# Altium project NodeLORA.PrjPcb
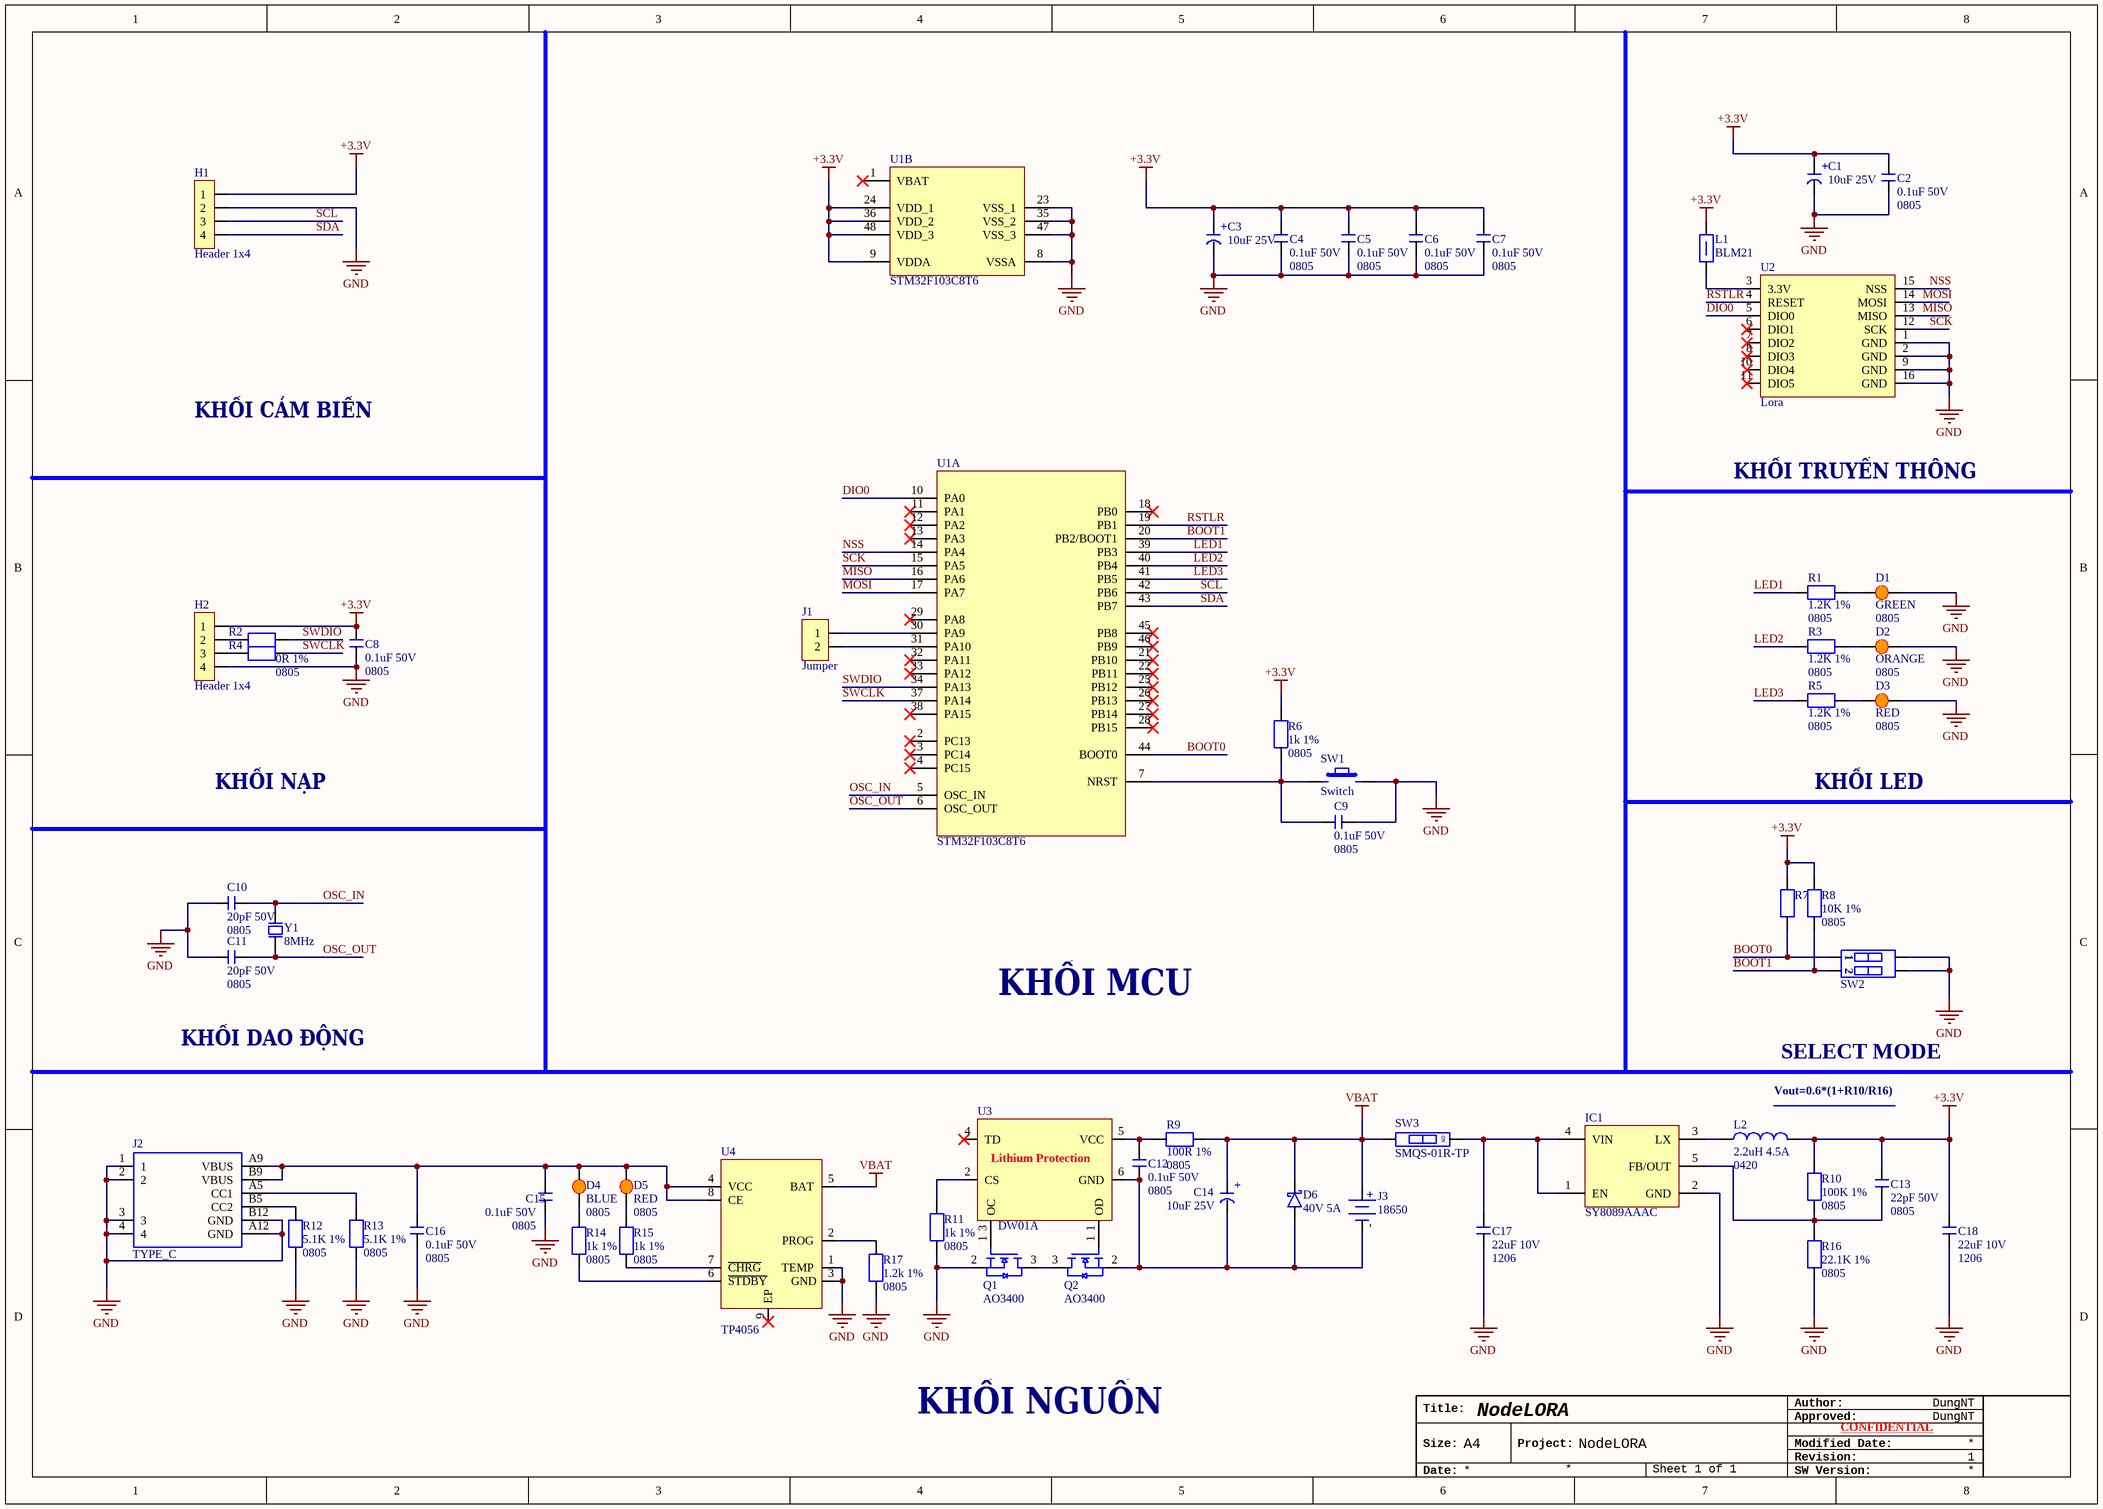
[diagram p0: NodeLORA.SchDoc]
1 sheet, 59 parts. Net scope: global (net labels, ports and power ports of the same name join across sheets).
Board file: NodeLORA.PcbDoc

## Sheet NodeLORA.SchDoc: NodeLORA
size A3; ApprovedBy: DungNT; Author: DungNT; Revision: 1; SheetNumber: 1; SheetTotal: 1; ProjectTitle: NodeLORA

### Parts
C1  10uF 25V  [CAP-ALU-B]
C2  0.1uF 50V  Package: 0805  [C0805]
C3  10uF 25V  [CAP-ALU-B]
C4  0.1uF 50V  Package: 0805  [C0805]
C5  0.1uF 50V  Package: 0805  [C0805]
C6  0.1uF 50V  Package: 0805  [C0805]
C7  0.1uF 50V  Package: 0805  [C0805]
C8  0.1uF 50V  Package: 0805  [C0805]
C9  0.1uF 50V  Package: 0805  [C0805]
C10  20pF 50V  Package: 0805  [C0805]
C11  20pF 50V  Package: 0805  [C0805]
C12  0.1uF 50V  Package: 0805  [C0805]
C13  22pF 50V  Package: 0805  [C0805]
C14  10uF 25V  [CAP-ALU-B]
C15  0.1uF 50V  Package: 0805  [C0805]
C16  0.1uF 50V  Package: 0805  [C0805]
C17  22uF 10V  Package: 1206  [C1206]
C18  22uF 10V  Package: 1206  [C1206]
D1  GREEN  Package: 0805  [L0805-GREEN]
D2  ORANGE  Package: 0805  [L0805-ORANGE]
D3  RED  Package: 0805  [L0805-RED]
D4  BLUE  Package: 0805  [L0805-BLUE]
D5  RED  Package: 0805  [L0805-RED]
D6  40V 5A  [SMA(DO-214AC)]
H1  Header 1x4  [H1x4M]
H2  Header 1x4  [H1x4M]
IC1  SY8089AAAC  [SOT-23-5]
J1  Jumper  [JUMPER2x]
J2  TYPE_C  [TYPE C 6P]
J3  18650  [18650-PLUGIN]
L1  BLM21  [L0805]
L2  2.2uH 4.5A  Package: 0420  [L0420]
Q1  AO3400  [SOT-23]
Q2  AO3400  [SOT-23]
R1  1.2K 1%  Package: 0805  [R0805]
R2  0R 1%  [R0805]  (value not drawn)
R3  1.2K 1%  Package: 0805  [R0805]
R4  0R 1%  Package: 0805  [R0805]
R5  1.2K 1%  Package: 0805  [R0805]
R6  1k 1%  Package: 0805  [R0805]
R7  10K 1%  [R0805]  (value not drawn)
R8  10K 1%  Package: 0805  [R0805]
R9  100R 1%  Package: 0805  [R0805]
R10  100K 1%  Package: 0805  [R0805]
R11  1k 1%  Package: 0805  [R0805]
R12  5.1K 1%  Package: 0805  [R0805]
R13  5.1K 1%  Package: 0805  [R0805]
R14  1k 1%  Package: 0805  [R0805]
R15  1k 1%  Package: 0805  [R0805]
R16  22.1K 1%  Package: 0805  [R0805]
R17  1.2k 1%  Package: 0805  [R0805]
SW1  Switch  [SW_6X3.5mm_2SMD]
SW2  VDG-02HG-R  [DIPSWITCHES_2P]  (value not drawn)
SW3  SMQS-01R-TP  [SMSWITCH_1P]
U1  STM32F103C8T6  [LQFP-48]  (parts A,B of 2)
U2  Lora  [RA-02-SX1278]
U3  DW01A  [SOT-23-6]
U4  TP4056  [ESOP-8]
Y1  8MHz  [5032-2]

### Nets
+3.3V: C1.1 C2.2 C3.1 C4.2 C5.2 C6.2 C7.2 C8.2 C13.2 C18.2 H1.1 H2.1 L1.2 L2.2 R6.1 R7.2 R8.2 R10.2 U1.9(VDDA) U1.24(VDD_1) U1.36(VDD_2) U1.48(VDD_3)
GND: C1.2 C2.1 C3.2 C4.1 C5.1 C6.1 C7.1 C8.1 C9.1 C10.1 C11.1 C15.1 C16.1 C17.1 C18.1 D1.2 D2.2 D3.2 H1.2 H2.4 IC1.2(GND) J2.1 J2.2 J2.3 J2.4 J2.A12(GND) J2.B12(GND) Q1.2(Source) R11.2 R12.1 R13.1 R16.1 R17.1 SW1.2 SW2.3 SW2.4 U1.8(VSSA) U1.23(VSS_1) U1.35(VSS_2) U1.47(VSS_3) U2.1(GND) U2.2(GND) U2.9(GND) U2.16(GND) U4.1(TEMP) U4.3(GND)
VBAT: C14.1 D6.2 J3.1 R9.2 SW3.1 U4.5(BAT)
BOOT0: R7.1 SW2.1 U1.44(BOOT0)
BOOT1: R8.1 SW2.2 U1.20(PB2/BOOT1)
DIO0: U1.10(PA0) U2.5(DIO0)
LED1: R1.1 U1.39(PB3)
LED2: R3.1 U1.40(PB4)
LED3: R5.1 U1.41(PB5)
MISO: U1.16(PA6) U2.13(MISO)
MOSI: U1.17(PA7) U2.14(MOSI)
NSS: U1.14(PA4) U2.15(NSS)
OSC_IN: C10.2 U1.5(OSC_IN) Y1.2
OSC_OUT: C11.2 U1.6(OSC_OUT) Y1.1
RSTLR: U1.19(PB1) U2.4(RESET)
SCK: U1.15(PA5) U2.12(SCK)
SCL: H1.3 U1.42(PB6)
SDA: H1.4 U1.43(PB7)
SWCLK: R4.2 U1.37(PA14)
SWDIO: R2.2 U1.34(PA13)
NetC9_2: C9.2 R6.2 SW1.1 U1.7(NRST)
NetC12_1: C12.1 C14.2 D6.1 J3.2 Q2.2(Source) U3.6(GND)
NetC12_2: C12.2 R9.1 U3.5(VCC)
NetC13_1: C13.1 IC1.5(FB/OUT) R10.1 R16.2
NetC15_2: C15.2 C16.2 D4.1 D5.1 J2.A9(VBUS) J2.B9(VBUS) U4.4(VCC) U4.8(CE)
NetC17_2: C17.2 IC1.1(EN) IC1.4(VIN) SW3.2
NetD1_1: D1.1 R1.2
NetD2_1: D2.1 R3.2
NetD3_1: D3.1 R5.2
NetD4_2: D4.2 R14.1
NetD5_2: D5.2 R15.1
NetH2_2: H2.2 R2.1
NetH2_3: H2.3 R4.1
NetIC1_3: IC1.3(LX) L2.1
NetJ1_1: J1.1 U1.30(PA9)
NetJ1_2: J1.2 U1.31(PA10)
NetJ2_A5: J2.A5(CC1) R13.2
NetJ2_B5: J2.B5(CC2) R12.2
NetL1_1: L1.1 U2.3(3.3V)
NetQ1_1: Q1.1(Gate) U3.3(OC)
NetQ1_3: Q1.3(Drain) Q2.3(Drain)
NetQ2_1: Q2.1(Gate) U3.1(OD)
NetR11_1: R11.1 U3.2(CS)
NetR14_2: R14.2 U4.6(~{STDBY})
NetR15_2: R15.2 U4.7(~{CHRG})
NetR17_2: R17.2 U4.2(PROG)

Not connected (* = marked no-connect by the designer): U1 1(VBAT)* 2(PC13)* 3(PC14)* 4(PC15)* 11(PA1)* 12(PA2)* 13(PA3)* 18(PB0)* 21(PB10)* 22(PB11)* 25(PB12)* 26(PB13)* 27(PB14)* 28(PB15)* 29(PA8)* 32(PA11)* 33(PA12)* 38(PA15)* 45(PB8)* 46(PB9)*; U2 6(DIO1)* 7(DIO2)* 8(DIO3)* 10(DIO4)* 11(DIO5)*; U3 4(TD)*; U4 9(EP)*

### Notes on the sheet
- KHỐI CẢM BIẾN
- KHỐI TRUYỀN THÔNG
- KHỐI NẠP
- KHỐI LED
- KHỐI DAO ĐỘNG
- KHỐI MCU
- (near L2) Vout=0.6*(1+R10/R16)
- SELECT MODE
- KHỐI NGUỒN
- Author:
- Title:
- Size:
- A4
- Project:
- Approved:
- Revision:
- Modified Date:
- CONFIDENTIAL
- Date:
- SW Version:
- (in symbol BitSwitch_1P) ON
- (in symbol CAP_ALU_B_10uF_25V) +
- (in symbol DW01A) Lithium Protection
- (in symbol Lithium 18650) +; -

### Library data of the parts
C1 C3 C14 = CAP_ALU_B_10uF_25V: 10uF 25V 15mA@120Hz ±20% SMD,D4xL5.4mm Aluminum Electrolytic Capacitors - SMD ROHS; Manufacturer: DMBJ; Manufacturer Product Number: RVT1E100M0405 10UF 25V; Link: https://www.lcsc.com/product-detail/Aluminum-Electrolytic-Capacitors-SMD_DMBJ-RVT1E100M0405-10UF-25V_C970655.html; Price: $ 0.0183; Size: B
C2 C4-C9 C12 C15 C16 = C0805_0.1uF_50V_10%: 0.1 µF ±10% 50V Ceramic Capacitor X7R 0805 (2012 Metric); Manufacturer: YAGEO; Manufacturer Product Number: CC0805KRX7R9BB104; VNprice: 180; Link: https://www.digikey.com/en/products/detail/yageo/CC0805KRX7R9BB104/302874; Price: 0.10; VNlink: https://linhkien.cxt.vn/1976-tu-104k-01uf-100nf-0805-50v-10-10c.html
C10 C11 = C0805_20pF_50V_10%: 20 pF ±10% 50V Ceramic Capacitor X7R 0805 (2012 Metric); Manufacturer: KEMET; Manufacturer Product Number: C0805C200K5RAC7800; VNprice: 180; Link: https://www.digikey.com/en/products/detail/kemet/C0805C200K5RAC7800/8572459; Price: 0.28; VNlink: https://linhkien.cxt.vn/2901-tu-20pf-0805-50v-10c.html
C13 = C0805_22pF_50V_10%: 22 pF ±10% 50V Ceramic Capacitor C0G, NP0 0805 (2012 Metric); Manufacturer: KEMET; Manufacturer Product Number: C0805C220K5GAC7800; VNprice: 180; Link: https://www.digikey.com/en/products/detail/kemet/C0805C220K5GAC7800/2212195; Price: 0.1; VNlink: https://linhkien.cxt.vn/1061-tu-khong-phan-cuc-0805.html
C17 C18 = C1206_22uF_10V_10%: 22 µF ±20% 10V Ceramic Capacitor X7R 1206 (3216 Metric); Manufacturer: Samsung Electro-Mechanics; Manufacturer Product Number: CL31B226MPHNNNE; VNprice: 400; Link: https://www.digikey.com/en/products/detail/samsung-electro-mechanics/CL31B226MPHNNNE/3888806; Price: 0.37; VNlink: https://linhkien.cxt.vn/4805-tu-khong-phan-cuc-1206.html
D1 = LED_0805_GREEN: Green 570nm LED Indication - Discrete 2.1V 0805 (2012 Metric); Manufacturer: Kingbright; Manufacturer Product Number: APHCM2012CGCK-F01; VNprice: 530; Link: https://www.digikey.com/en/products/detail/kingbright/APHCM2012CGCK-F01/1747492?s=N4IgTCBcDaIAQEEAKAJAwgWTABgIxjQHE0BpAMTxAF0BfIA; Price: 0.34; VNlink: https://linhkien.cxt.vn/10107-17-21ghc-yr1t13t-led-0805-sang-mau-xanh-luc-emerald-10c.html
D2 = LED_0805_ORANGE: Orange 601nm LED Indication - Discrete 2.1V 0805 (2012 Metric); Manufacturer: Kingbright; Manufacturer Product Number: APHCM2012SECKF01; VNprice: 230; Link: https://www.digikey.com/en/products/detail/kingbright/APHCM2012SECK-F01/1747494?s=N4IgTCBcDaIIIAUASBhAsmADARjAZQFEUBpAMRxAF0BfIA; Price: 0.32; VNlink: https://linhkien.cxt.vn/6701-led-0805-cac-mau.html
D3 D5 = LED_0805_RED: 20mA 350mcd Colorless transparent lens 625nm Red 120° 2.2V 0805 LED Indication - Discrete ROHS; Manufacturer: Kingbright; Manufacturer Product Number: APT2012SECK/J3-PRV; VNprice: 530; Link: https://www.lcsc.com/product-detail/span-style-background-color-ff0-LED-span-Indication-Discrete_Kingbright-APT2012SECK-J3-PRV_C5569452.html; Price: 0.2831; VNlink: https://linhkien.cxt.vn/10106-17-21surcs530-a3tr8-led-red-0805-624nm-10c.html
D4 = LED_0805_BLUE: Blue 470nm LED Indication - Discrete 3.3V 0805 (2012 Metric); Manufacturer: LiteOnInc; Manufacturer Product Number: LTSTC170TBKT; VNprice: 600; Link: https://www.digikey.com/en/products/detail/liteon/LTST-C170TBKT/388527?s=N4IgTCBcDaIAQBkAqBlJBhAjAdgAxICEBpJEAXQF8g; Price: 0.38; VNlink: https://linhkien.cxt.vn/6340-150080bs75000-led-sang-mau-xanh-duong-blue-clear-0805-smd.html
D6 = Diode_40V_5V_SMA: 40V Independent Type 550mV@5.0A 5A SMA(DO-214AC) Schottky Diodes ROHS; Manufacturer: hongjiacheng; Manufacturer Product Number: SS54; VNprice: 1600; Link: https://www.lcsc.com/product-detail/Schottky-Diodes_hongjiacheng-SS54_C7420369.html; Price: 0.0336; Package: SMA(DO-214AC); VNlink: https://linhkien.cxt.vn/8500-1n5824-ss54-sma-diode-schottky-5a-40v.html
H1 H2 = Header 1x4 2.54mm: Connector Header 4 position; Manufacturer: Adam Tech; Manufacturer Product Number: ADT-AMP1251104S2BS192A1; Link: https://www.digikey.com/en/products/detail/adam-tech/ADT-AMP1251104S2BS192A1/9832039; Price: 0.30000
IC1 = SY8089AAAC: Step-down type 2A 2.7V~5.5V SOT-23-5 DC-DC Converters ROHS; Manufacturer: MaxLinear, Inc.; Manufacturer Product Number: SPX3819M5-L-3-3/TR; VNprice: 3500; Current - Quiescent (Iq): 8 µA; Current - Supply (Max): 30 mA; Voltage - Input (Max): 16V; Link: https://www.lcsc.com/product-detail/DC-DC-Converters_Silergy-Corp-SY8089AAAC_C78988.html; Price: 0.1481; VNlink: https://linhkien.cxt.vn/5370-sy8089a1aac-conv-dc-dc-single-step-down-55v-sot-23.html; Package: SOT-23-5; Input Voltage: 2.7V~5.5V; Current - Output: 2A; Operating Temperature: -40℃~+85℃@(TA); Topology: Step-down
J1 = Jumper 2P: 40 Position Receptacle Connector 0.100" (2.54mm) Through Hole; Manufacturer: Marutsuelec; Manufacturer Product Number: 21601X40GSE; VNprice: 130; Link: https://www.digikey.com/en/products/detail/marutsuelec/21601X40GSE/21669074; Price: 0.23; VNlink: https://linhkien.cxtvn.com/2835-jump-chot-cac-mau-254mm.html
J2 = Type C 6P: Manufacturer: Hanbo Electronic; Manufacturer Product Number: MC-301D-H20; VNprice: 1000; Link: https://www.lcsc.com/product-detail/USB-Connectors_Hanbo-Electronic-MC-301D-H20_C7432477.html; Price: 0.1471; VNlink: https://linhkien.cxt.vn/8166-cong-type-c-cai-6p-4-chan-co-dinh.html
J3 = Lithium 18650: Battery box 18650 SMD Button And Strip Battery Connector ROHS; Manufacturer: MYOUNG; Manufacturer Product Number: BH-18650-B1BA002; VNprice: 13000; VNprice Plugin: 5500; Link: https://www.lcsc.com/product-detail/Battery-Connectors_MYOUNG-BH-18650-B1BA002_C2988620.html; Price: 1.08; VNlink: https://linhkien.cxt.vn/9549-de-pin-18650-1-cell-han-dan-77x208mm.html; VNlink Plugin: https://linhkien.cxt.vn/6821-de-pin-18650-1-cell-han-mach.html
L1 = BLM21PG121BH1D: 120 Ohms @ 100 MHz 1 Power Line Ferrite Bead 0805 (2012 Metric) 1.55A 30mOhm; Manufacturer: Murata Electronics; VNprice: 300; Manufacturer Product Number: BLM21PG121BH1D; Link: https://www.digikey.com/en/products/detail/murata-electronics/blm21pg121bh1d/10702696?_gl=1*1cqgywr*_up*MQ..*_gs*MQ..&gclid=Cj0KCQjwpP63BhDYARIsAOQkATayJr9wkNih7WH9IZ04A1s7wgSB7TmpdGB8wZexjyTXcSZgPREQqjgaAodYEALw_wcB; Price: 0.11; Package: 0805; VNlink: https://linhkien.cxt.vn/6265-ferrite-beads-smd0805-cac-gia-tri.html
L2 = L0420_2.2uH_4.5A: 4.5A 2.2uH Integrated molded inductor ±20% 5A SMD,0420 Power Inductors ROHS; Manufacturer: TECHFUSE; Manufacturer Product Number: SL0420-2R2M; VNprice: 2000; Link: https://www.lcsc.com/product-detail/Inductors-SMD_TECHFUSE-SL0420-2R2M_C22463806.html; Price: 0.0985; VNlink: https://linhkien.cxt.vn/7877-cuon-cam-0420-cac-gia-tri.html
Q1 Q2 = AO3400: 30V 5.8A 21mΩ@10V,5.8A 1.4W 1V@250uA 1 N-Channel SOT-23 MOSFETs ROHS; Manufacturer: ElecSuper; VNprice: 900; Manufacturer Product Number: AO3400; Link: https://www.lcsc.com/product-detail/MOSFETs_ElecSuper-AO3400_C5224189.html; Price: 0.021; VNlink: https://linhkien.cxt.vn/2689-ao3400-mosfet-n-ch-30v-58a-sot23-3.html; Package: SOT-23-3
R1 R3 R5 = R0805_1.5K: 1.5 kOhms ±1% 0.125W, 1/8W Chip Resistor 0805 (2012 Metric) Automotive AEC-Q200 Thick Film; Manufacturer: Stackpole Electronics Inc; Manufacturer Product Number: RMCF0805FT1K50; VNprice: 46; Link: https://www.digikey.com/en/products/detail/stackpole-electronics-inc/RMCF0805FT1K50/1760652; Price: 0.10; VNlink: https://linhkien.cxt.vn/2666-dien-tro-0805-1-thong-so-tu-1k-den-91k.html
R2 R4 = R0805_0R: 0 Ohms ±1% 0.125W, 1/8W Chip Resistor 0805 (2012 Metric) Anti-Sulfur Thick Film; Manufacturer: Thin Film Technology Corp.; Manufacturer Product Number: D1TFAS0805WJUMPF-T5; VNprice: 46; Link: https://www.digikey.com/en/products/detail/thin-film-technology-corp/D1TFAS0805WJUMPF-T5/22983913; Price: 0.10; VNlink: https://linhkien.cxt.vn/2899-dien-tro-0r-0805-1-50c.html
  R2: Package: 0805
R6 R11 R14 R15 = R0805_1K: 1 kOhms ±1% 0.125W, 1/8W Chip Resistor 0805 (2012 Metric) Automotive AEC-Q200 Thick Film; Manufacturer: Stackpole Electronics Inc; Manufacturer Product Number: RMCF0805FT1K00; VNprice: 46; Link: https://www.digikey.com/en/products/detail/stackpole-electronics-inc/RMCF0805FT1K00/1760090; Price: 0.10; VNlink: https://linhkien.cxt.vn/2346-dien-tro-1k-0805-1-50c.html
R7 R8 = R0805_10K: 10 kOhms ±1% 0.125W, 1/8W Chip Resistor 0805 (2012 Metric) Automotive AEC-Q200 Thick Film; Manufacturer: Stackpole Electronics Inc; Manufacturer Product Number: RMCF0805FT10K0; VNprice: 36; Link: https://www.digikey.com/en/products/detail/stackpole-electronics-inc/RMCF0805FT10K0/1760676; Price: 0.10; VNlink: https://linhkien.cxt.vn/6741-dien-tro-10k-0805-1-50c.html
  R7: Package: 0805
R9 = R0805_100R: 100 Ohms ±1% 0.125W, 1/8W Chip Resistor 0805 (2012 Metric) Automotive AEC-Q200 Thick Film; Manufacturer: Stackpole Electronics Inc; Manufacturer Product Number: RMCF0805FT100R; VNprice: 46; Link: https://www.digikey.com/en/products/detail/stackpole-electronics-inc/RMCF0805FT100R/1760711; Price: 0.10; VNlink: https://linhkien.cxt.vn/2343-dien-tro-0805-1-thong-so-tu-0r-den-910r.html
R10 = R0805_100K: 100 kOhms ±1% 0.125W, 1/8W Chip Resistor 0805 (2012 Metric) Automotive AEC-Q200 Thick Film; Manufacturer: Stackpole Electronics Inc; Manufacturer Product Number: RMCF0805FG100K; VNprice: 46; Link: https://www.digikey.com/en/products/detail/stackpole-electronics-inc/RMCF0805FG100K/1712614; Price: 0.10; VNlink: https://linhkien.cxt.vn/2352-dien-tro-100k-0805-1-50c.html
R12 R13 = R0805_5.1K: 5.1 kOhms ±1% 0.125W, 1/8W Chip Resistor 0805 (2012 Metric) Automotive AEC-Q200 Thick Film; Manufacturer: Stackpole Electronics Inc; Manufacturer Product Number: RMCF0805FT5K10; VNprice: 46; Link: https://www.digikey.com/en/products/detail/stackpole-electronics-inc/RMCF0805FT5K10/1760394; Price: 0.1; VNlink: https://linhkien.cxt.vn/3017-dien-tro-51k-0805-1-50c.html
R16 = R0805_22.1K: 22.1 kOhms ±1% 0.125W, 1/8W Chip Resistor 0805 (2012 Metric) Automotive AEC-Q200 Thick Film; Manufacturer: Stackpole Electronics Inc; Manufacturer Product Number: RMCF0805FT22K1; VNprice: 46; Link: https://www.digikey.com/en/products/detail/stackpole-electronics-inc/RMCF0805FT22K1/1760211; Price: 0.10; VNlink: https://linhkien.cxt.vn/6147-dien-tro-0805-1-thong-so-tu-1k-den-91k.html
R17 = R0805_1.2K: 1.2 kOhms ±1% 0.125W, 1/8W Chip Resistor 0805 (2012 Metric) Automotive AEC-Q200 Thick Film; Manufacturer: Stackpole Electronics Inc; Manufacturer Product Number: RMCF0805FT1K20; VNprice: 46; Link: https://www.digikey.com/en/products/detail/stackpole-electronics-inc/RMCF0805FT1K20/1760625; Price: 0.10; VNlink: https://linhkien.cxt.vn/2347-dien-tro-0805-1-thong-so-tu-1k-den-91k.html
SW1 = Switch_2SMD: Tactile Switch SPST-NO Top Actuated Surface Mount; Manufacturer: Omron Electronics Inc-EMC Div; Manufacturer Product Number: B3U-1000P; Base Product Number: B3U; VNprice: 440; Link: https://www.digikey.com/en/products/detail/omron-electronics-inc-emc-div/B3U-1000P/1534338; Price: 1.16; Link2: https://www.digikey.cn/en/products/detail/c-k/PTS636-SM25F-SMTR-LFS/10071742?s=N4IgTCBcDaIAoBUDKA2AzCgBEgsmArAGLY4IBKmAMoUiALoC%2BQA; Price2: ¥1.95000; VNlink: https://linhkien.cxt.vn/1784-nut-nhan-smd-2p.html
SW2 = BitSwitch_2P: 1 Digit 24V 25mA Red 5 Thousand Times Flat Toggle, Raised Style DIP Switches ROHS; Manufacturer: Cixi Tonver Elec; VNprice: 1800; Manufacturer Product Number: VDG-02HG-R; Link: https://www.lcsc.com/product-detail/span-style-background-color-ff0-DIP-span-span-style-background-color-ff0-Switches-span_Cixi-Tonver-Elec-VDG-02HG-R_C3661.html; Price: 0.1568; VNlink: https://linhkien.cxt.vn/2892-cong-tac-bit-254mm-chan-cam-thang.html
SW3 = BitSwitch_1P: 1 Digit 24V 25mA Red 5 Thousand Times Flat Toggle, Raised Style DIP Switches ROHS; Manufacturer: SM Switch; VNprice: 2000; Manufacturer Product Number: SMQS-01R-TP; Link: https://www.lcsc.com/product-detail/DIP-Switches_SM-Switch-SMQS-01R-TP_C5299502.html; Price: 0.1597; VNlink: https://linhkien.cxt.vn/3473-cong-tac-bit-254mm-chan-cam-thang.html
U1 = STM32F103C8T6: ARM® Cortex®-M3 STM32F1 Microcontroller IC 32-Bit Single-Core 72MHz 64KB (64K x 8) FLASH; Manufacturer: STMicroelectronics; VNprice: 28000; Connectivity: CANbus, I2C, IrDA, LINbus, SPI, UART/USART, USB; Peripherals: DMA, Motor Control PWM, PDR, POR, PVD, PWM, Temp Sensor, WDT; Number of I/O: 37; RAM Size: 20K x 8; Voltage - Supply (Vcc/Vdd): 2V ~ 3.6V; Data Converters: A/D 10x12b; Oscillator Type: Internal; Manufacturer Product Number: STM32F103C8T6; Link: https://www.digikey.com/en/products/detail/stmicroelectronics/STM32F103C8T6/1646338; Price: 6.11; VNlink: https://linhkien.cxt.vn/1130-stm32f103c8t6.html; Package: 48-LQFP; Core Processor: ARM® Cortex®-M3; Core Size: 32-Bit Single-Core; Speed: 72MHz; Program Memory Size: 64KB (64K x 8); Program Memory Type: FLASH; Operating Temperature: -40°C ~ 85°C (TA); Mounting Type: Surface Mount; Base Product Number: STM32F103
U2 = Ra-02: -140dBm 20dBm SPI SMD-16P LoRa Modules ROHS; Manufacturer: Ai-Thinker; VNprice: 115000; Manufacturer Product Number: Ra-02; Link: https://www.lcsc.com/product-detail/LoRa-Modules_Ai-Thinker-Ra-02_C90039.html; Price: 5.5811; VNlink: https://linhkien.cxt.vn/3446-module-wireless-sx1278-lora-ra-02-433mhz.html; Package: SMD-16P
U3 = DW01A: -300mV~8V Lithium-ion/Polymer 1 SOT-23-6 Battery Management ROHS; Manufacturer: YONGYUTAI; VNprice: 1000; Manufacturer Product Number: DW01A; Link: https://www.lcsc.com/product-detail/Battery-Management_YONGYUTAI-DW01A_C2927799.html; Price: 0.0295; VNlink: https://linhkien.cxt.vn/6473-dw01a-ic-bao-ve-pin-sot23-6.html; Package: SOT-23-6
U4 = TP4056: ESOP-8 Battery Management ROHS; Manufacturer: TOPPOWER(Nanjing Extension Microelectronics); Manufacturer Product Number: TP4056-42-ESOP8; VNprice: 2000; Link: https://www.lcsc.com/product-detail/Battery-Management_TOPPOWER-Nanjing-Extension-Microelectronics-TP4056-42-ESOP8_C16581.html; Price: 0.1727; VNlink: https://linhkien.cxt.vn/1268-tp4056-ic-battery-management-1a-esop-8-umw.html; Package: ESOP-8
Y1 = 5032_8MHz: 8MHz Surface Mount Crystal 18pF ±30ppm SMD5032 Crystals ROHS; Manufacturer: TXC Corp; Manufacturer Product Number: AA08000016; VNprice: 4400; Link: https://www.lcsc.com/product-detail/Crystals_TXC-Corp-AA08000016_C409346.html; Price: 0.4319; VNlink: https://linhkien.cxt.vn/1388-thach-anh-5032-2-chan-dan.html; Package: 5032